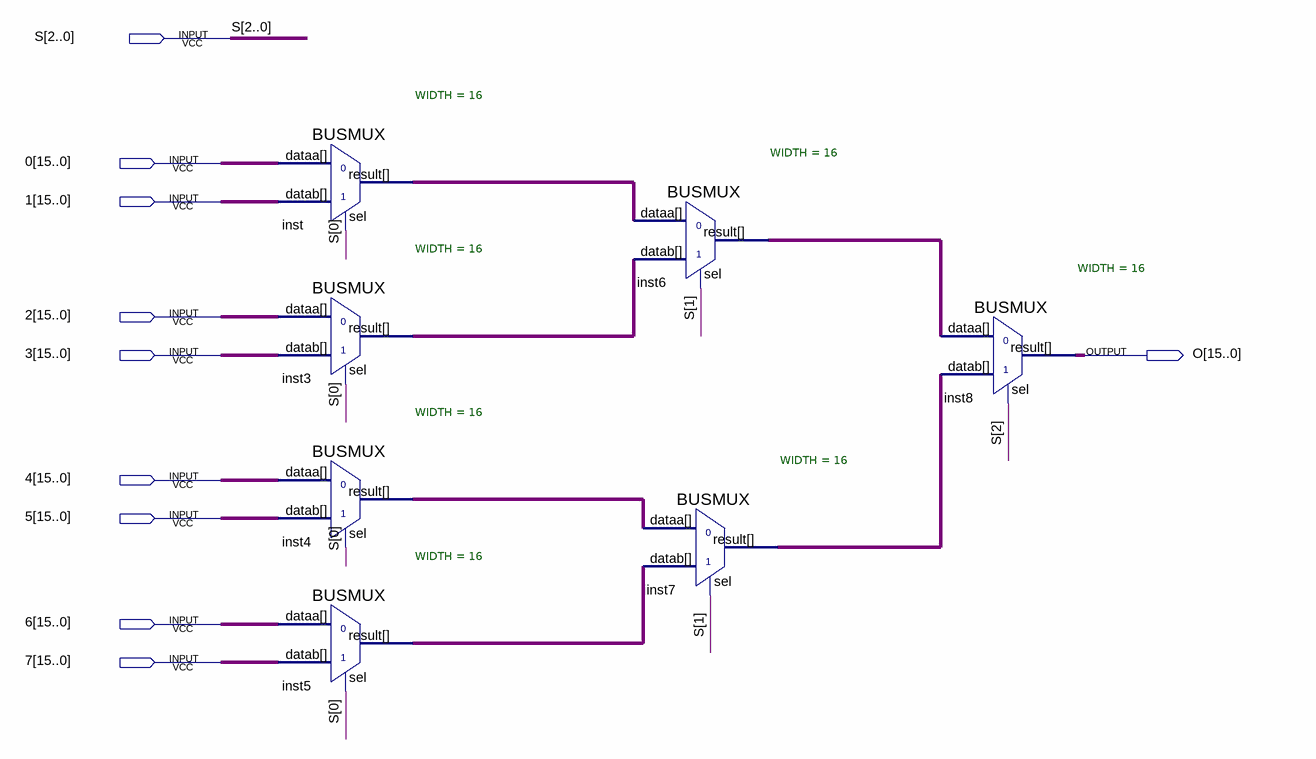
[diagram p0: schematic sheet]
// Quartus schematic MUX8_1.bdf as structural Verilog: 7 symbols, 10 pins
module MUX8_1 (
  input  [2:0] S,
  input  [15:0] \0 ,
  input  [15:0] \1 ,
  input  [15:0] \2 ,
  input  [15:0] \3 ,
  input  [15:0] \4 ,
  input  [15:0] \5 ,
  input  [15:0] \6 ,
  input  [15:0] \7 ,
  output [15:0] O
);

  wire [15:0] inst3_result, inst4_result, inst5_result, inst6_result, inst7_result, inst_result;

  BUSMUX #(.WIDTH(16)) inst (.datab(\1 ), .sel(S[0]), .dataa(\0 ), .result(inst_result));
  BUSMUX #(.WIDTH(16)) inst3 (.datab(\3 ), .sel(S[0]), .dataa(\2 ), .result(inst3_result));
  BUSMUX #(.WIDTH(16)) inst4 (.datab(\5 ), .sel(S[0]), .dataa(\4 ), .result(inst4_result));
  BUSMUX #(.WIDTH(16)) inst5 (.datab(\7 ), .sel(S[0]), .dataa(\6 ), .result(inst5_result));
  BUSMUX #(.WIDTH(16)) inst6 (.datab(inst3_result), .sel(S[1]), .dataa(inst_result), .result(inst6_result));
  BUSMUX #(.WIDTH(16)) inst7 (.datab(inst5_result), .sel(S[1]), .dataa(inst4_result), .result(inst7_result));
  BUSMUX #(.WIDTH(16)) inst8 (.datab(inst7_result), .sel(S[2]), .dataa(inst6_result), .result(O));
endmodule
